# EasyEDA schematic SCH_13W3 to DA15 Apple Display Adapter_2023-02-26.json
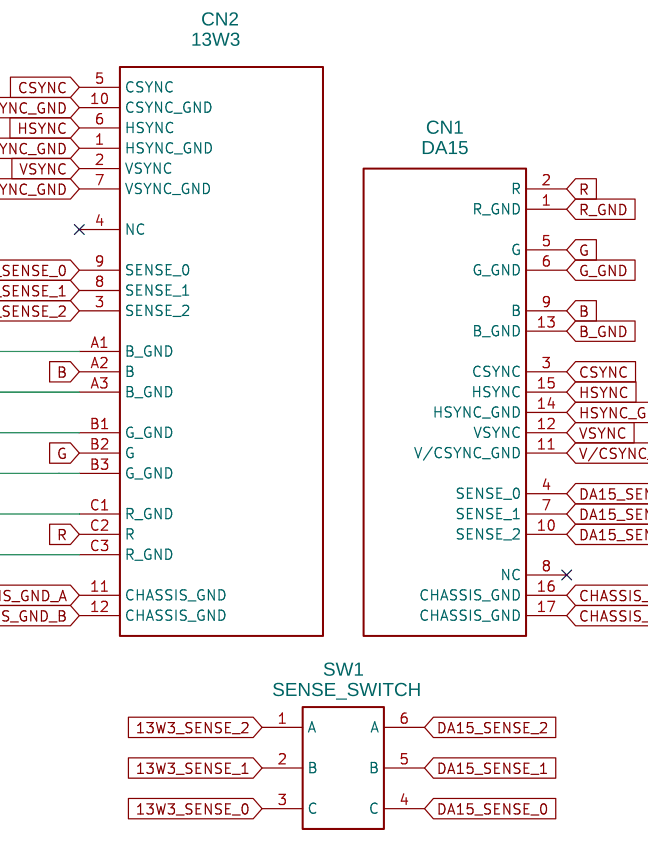
[diagram p0: schematic sheet]

## Parts
CN1  DA15  [DA15_RIGHT_ANGLE_PCB_MOUNT]
CN2  13W3  [13W3_RIGHT_ANGLE_PCB_MOUNT]
SW1  SENSE_SWITCH  [DIP_SWITCH_3POS]

## Library data of the parts
CN1 = APPLE_DA15_VIDEO_CONNECTOR_PCB_MOUNT: Contributor: will_tooker
CN2 = 13W3_APPLE_VIDEO_RIGHT_ANGLE_PCB_MOUNT: Contributor: will_tooker
SW1 = DIP_SWITCH_3POS: Manufacturer: Wurth Elektronik; Manufacturer Part: 418117270903; Supplier: Mouser; Supplier Part: 710-418117270903; link: https://www.mouser.com/datasheet/2/445/418117270903-3087103.pdf; Contributor: will_tooker

## Nets
13W3_SENSE_0: CN2.9(SENSE_0) SW1.3(C)
13W3_SENSE_1: CN2.8(SENSE_1) SW1.2(B)
13W3_SENSE_2: CN2.3(SENSE_2) SW1.1(A)
B: CN1.9(B) CN2.A2(B)
B_GND: CN1.13(B_GND) CN2.A1(B_GND) CN2.A3(B_GND)
CHASSIS_GND_A: CN1.16(CHASSIS_GND) CN2.11(CHASSIS_GND)
CHASSIS_GND_B: CN1.17(CHASSIS_GND) CN2.12(CHASSIS_GND)
CSYNC: CN1.3(CSYNC) CN2.5(CSYNC)
DA15_SENSE_0: CN1.4(SENSE_0) SW1.4(C)
DA15_SENSE_1: CN1.7(SENSE_1) SW1.5(B)
DA15_SENSE_2: CN1.10(SENSE_2) SW1.6(A)
G: CN1.5(G) CN2.B2(G)
G_GND: CN1.6(G_GND) CN2.B1(G_GND) CN2.B3(G_GND)
HSYNC: CN1.15(HSYNC) CN2.6(HSYNC)
HSYNC_GND: CN1.14(HSYNC_GND) CN2.1(HSYNC_GND)
R: CN1.2(R) CN2.C2(R)
R_GND: CN1.1(R_GND) CN2.C1(R_GND) CN2.C3(R_GND)
V/CSYNC_GND: CN1.11(V/CSYNC_GND) CN2.7(VSYNC_GND) CN2.10(CSYNC_GND)
VSYNC: CN1.12(VSYNC) CN2.2(VSYNC)

Not connected (* = marked no-connect by the designer): CN1 8(NC)*; CN2 4(NC)*
